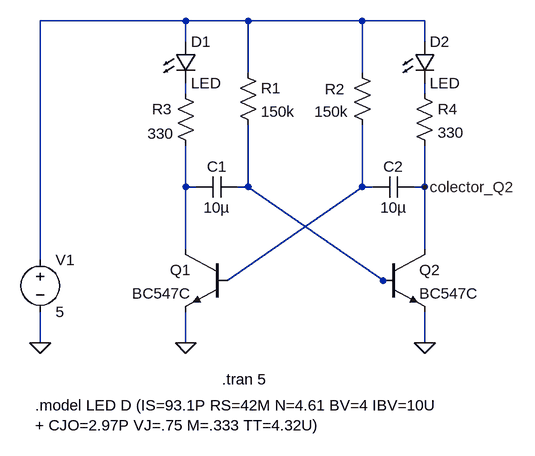
[diagram p0: schematic leds-intermitentes.asc]
leds-intermitentes.asc, the LTspice schematic file:
Version 4
SHEET 1 1236 680
WIRE 16 -816 -208 -816
WIRE 112 -816 16 -816
WIRE 288 -816 112 -816
WIRE 384 -816 288 -816
WIRE 16 -784 16 -816
WIRE 384 -784 384 -816
WIRE 112 -736 112 -816
WIRE 288 -736 288 -816
WIRE 16 -704 16 -720
WIRE 384 -704 384 -720
WIRE 16 -560 16 -624
WIRE 32 -560 16 -560
WIRE 112 -560 112 -656
WIRE 112 -560 96 -560
WIRE 288 -560 288 -656
WIRE 304 -560 288 -560
WIRE 384 -560 384 -624
WIRE 384 -560 368 -560
WIRE 16 -464 16 -560
WIRE 384 -464 384 -560
WIRE -208 -448 -208 -816
WIRE 80 -416 288 -560
WIRE 320 -416 112 -560
WIRE 336 -416 320 -416
WIRE -208 -320 -208 -368
WIRE 16 -320 16 -368
WIRE 384 -320 384 -368
FLAG 16 -320 0
FLAG -208 -320 0
FLAG 384 -320 0
FLAG 384 -560 colector_Q2
SYMBOL npn 320 -464 R0
SYMATTR InstName Q2
SYMATTR Value BC547C
SYMBOL res 368 -720 R0
SYMATTR InstName R4
SYMATTR Value 330
SYMBOL res 0 -720 R0
WINDOW 0 -36 40 Left 2
WINDOW 3 -43 78 Left 2
SYMATTR InstName R3
SYMATTR Value 330
SYMBOL res 96 -752 R0
SYMATTR InstName R1
SYMATTR Value 150k
SYMBOL res 272 -752 R0
WINDOW 0 -42 41 Left 2
WINDOW 3 -58 76 Left 2
SYMATTR InstName R2
SYMATTR Value 150k
SYMBOL cap 96 -576 R90
WINDOW 0 0 32 VBottom 2
WINDOW 3 32 32 VTop 2
SYMATTR InstName C1
SYMATTR Value 10µ
SYMBOL cap 368 -576 R90
WINDOW 0 0 32 VBottom 2
WINDOW 3 32 32 VTop 2
SYMATTR InstName C2
SYMATTR Value 10µ
SYMBOL voltage -208 -464 R0
WINDOW 123 0 0 Left 0
WINDOW 39 0 0 Left 0
SYMATTR InstName V1
SYMATTR Value 5
SYMBOL npn 80 -464 M0
SYMATTR InstName Q1
SYMATTR Value BC547C
SYMBOL LED 0 -784 R0
SYMATTR InstName D1
SYMATTR Value LED
SYMBOL LED 368 -784 R0
SYMATTR InstName D2
SYMATTR Value LED
TEXT 72 -264 Left 2 !.tran 5
TEXT -216 -224 Left 2 !.model LED D (IS=93.1P RS=42M N=4.61 BV=4 IBV=10U\n+ CJO=2.97P VJ=.75 M=.333 TT=4.32U)

The netlist it stands for:
* leds-intermitentes.asc
Q2 colector_Q2 N005 0 0 BC547C
R4 N003 colector_Q2 330
R3 N002 N004 330
R1 N001 N005 150k
R2 N001 N006 150k
C1 N005 N004 10µ
C2 colector_Q2 N006 10µ
V1 N001 0 5
Q1 N004 N006 0 0 BC547C
D1 N001 N002 LED
D2 N001 N003 LED
.model D D
.lib standard.dio
.model NPN NPN
.model PNP PNP
.lib standard.bjt
.tran 5
.model LED D (IS=93.1P RS=42M N=4.61 BV=4 IBV=10U
+ CJO=2.97P VJ=.75 M=.333 TT=4.32U)
.backanno
.end